# Altium schematic sheet adaptador.SchDoc
size A2
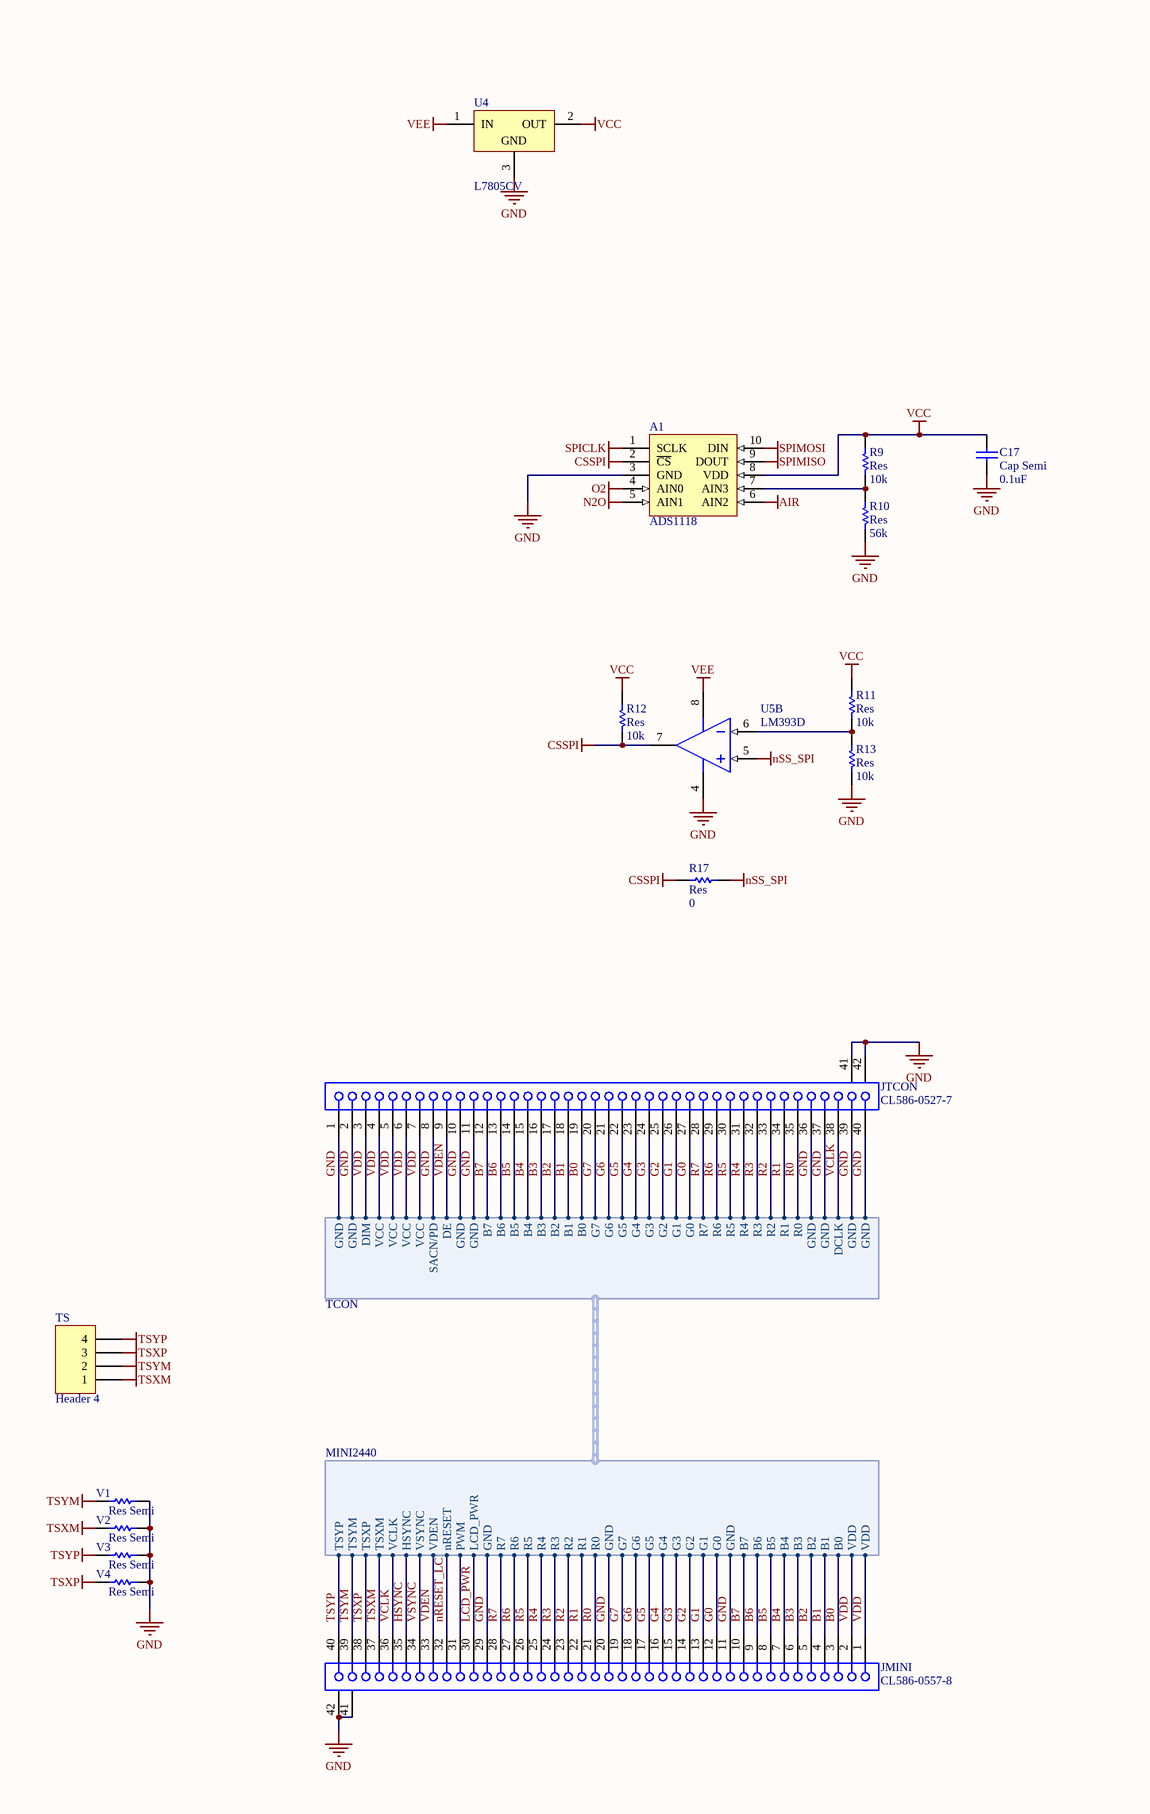
[diagram p0: adaptador.SchDoc, left]
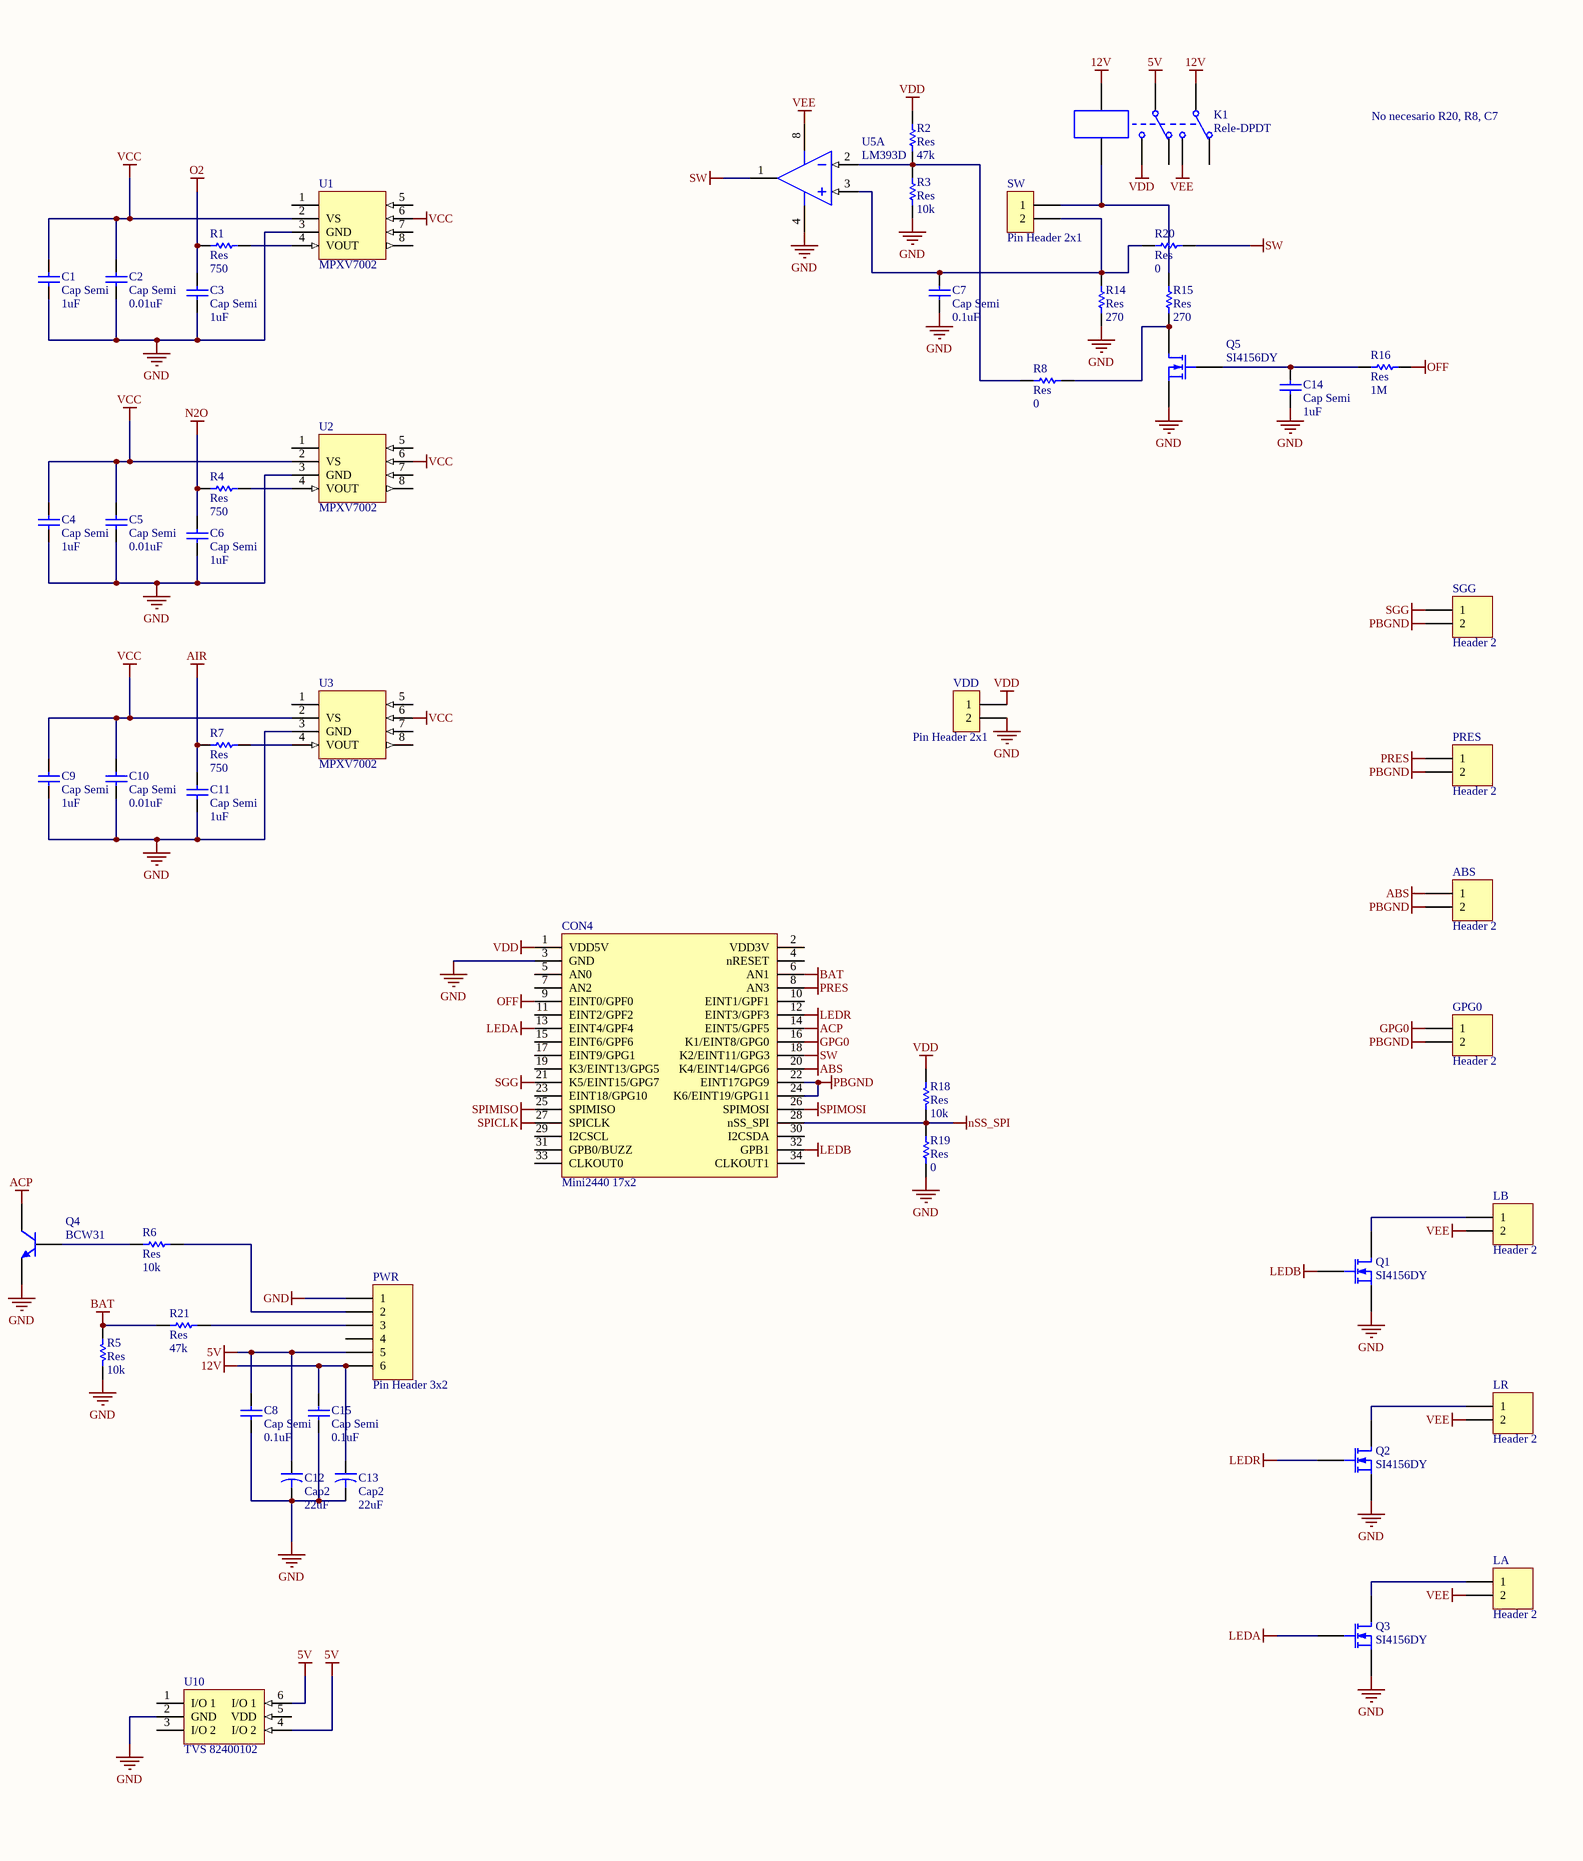
[diagram p1: adaptador.SchDoc, right]

## Parts
A1  ADS1118  [MSOP-10]
ABS  Header 2  [Sherlock2H]
C1  Cap Semi  value 1uF  [8-1206]
C2  Cap Semi  value 0.01uF  [8-1206]
C3  Cap Semi  value 1uF  [8-1206]
C4  Cap Semi  value 1uF  [8-1206]
C5  Cap Semi  value 0.01uF  [8-1206]
C6  Cap Semi  value 1uF  [8-1206]
C7  Cap Semi  value 0.1uF  [8-1206]
C8  Cap Semi  value 0.1uF  [8-1206]
C9  Cap Semi  value 1uF  [8-1206]
C10  Cap Semi  value 0.01uF  [8-1206]
C11  Cap Semi  value 1uF  [8-1206]
C12  Cap2  value 22uF  [CAPPR2-5x6.8]
C13  Cap2  value 22uF  [CAPPR2-5x6.8]
C14  Cap Semi  value 1uF  [8-1206]
C15  Cap Semi  value 0.1uF  [8-1206]
C17  Cap Semi  value 0.1uF  [8-1206]
CON4  Mini2440 17x2  [HDR2X17HV]
GPG0  Header 2  [Sherlock2H]
JMINI  CL586-0557-8  [FH12-40S-0.5SHD]
JTCON  CL586-0527-7  [FH12-40S-0.5SHD]
K1  Rele-DPDT  [RELE-DPDT]
LA  Header 2  [Sherlock2H]
LB  Header 2  [Sherlock2H]
LR  Header 2  [Sherlock2H]
PRES  Header 2  [Sherlock2H]
PWR  Pin Header 3x2  [bigHDR2X3]
Q1  SI4156DY  [SO8_M_MOSFET]
Q2  SI4156DY  [SO8_M_MOSFET]
Q3  SI4156DY  [SO8_M_MOSFET]
Q4  BCW31  [SOT-23A]
Q5  SI4156DY  [SO8_M_MOSFET]
R1  Res  value 750  [8-1206]
R2  Res  value 47k  [8-1206]
R3  Res  value 10k  [8-1206]
R4  Res  value 750  [8-1206]
R5  Res  value 10k  [8-1206]
R6  Res  value 10k  [8-1206]
R7  Res  value 750  [8-1206]
R8  Res  value 0  [8-1206]
R9  Res  value 10k  [8-1206]
R10  Res  value 56k  [8-1206]
R11  Res  value 10k  [8-1206]
R12  Res  value 10k  [8-1206]
R13  Res  value 10k  [8-1206]
R14  Res  value 270  [8-1206]
R15  Res  value 270  [8-1206]
R16  Res  value 1M  [8-1206]
R17  Res  value 0  [8-1206]
R18  Res  value 10k  [8-1206]
R19  Res  value 0  [8-1206]
R20  Res  value 0  [8-1206]
R21  Res  value 47k  [8-1206]
SGG  Header 2  [Sherlock2H]
SW  Pin Header 2x1  [Sherlock2H]
TS  Header 4  [HDR1X4]
U1  MPXV7002  [CASE 1351-01]
U2  MPXV7002  [CASE 1351-01]
U3  MPXV7002  [CASE 1351-01]
U4  L7805CV  [TO220ABN]
U5  LM393D  [SO8_M]  (parts A,B of 2)
U10  TVS 82400102  [SOT23-6]
V1  Res Semi  [RESC1608L]
V2  Res Semi  [RESC1608L]
V3  Res Semi  [RESC1608L]
V4  Res Semi  [RESC1608L]
VDD  Pin Header 2x1  [Sherlock2H]

## Harnesses
TCON: GND, GND, DIM, VCC, VCC, VCC, VCC, SACN/PD, DE, GND, GND, B7, B6, B5, B4, B3, B2, B1, B0, G7, G6, G5, G4, G3, G2, G1, G0, R7, R6, R5, R4, R3, R2, R1, R0, GND, GND, DCLK, GND, GND
MINI2440: GND, GND, GND, VDD, VDD, TSXM, TSXP, TSYM, TSYP, LCD_PWR, nRESET, VSYNC, HSYNC, VCLK, VDEN, PWM, R7, R0, R1, R2, R3, R4, R5, R6, G0, G1, G2, G3, G4, G5, G6, G7, B0, B1, B2, B3, B4, B5, B6, B7

## Nets
5V: C8.2 C12.1 K1.7 PWR.5 U10.4(I/O_2) U10.6(I/O_1)
12V: C13.1 C15.2 K1.2 K1.8 PWR.6
ABS: ABS.1 CON4.20(K4/EINT14/GPG6)
ACP: CON4.14(EINT5/GPF5) Q4.3(C)
AIR: A1.6(AIN2) C11.2 R7.1
BAT: CON4.6(AN1) R5.1 R21.2
CSSPI: A1.2(~{CS}) R12.2 R17.2 U5.7(OUT)
GND: A1.3(GND) C1.1 C2.1 C3.1 C4.1 C5.1 C6.1 C7.1 C8.1 C9.1 C10.1 C11.1 C12.2 C13.2 C14.1 C15.1 C17.1 CON4.3(GND) JMINI.11 JMINI.20 JMINI.29 JMINI.41(MH1) JMINI.42(MH2) JTCON.1 JTCON.2 JTCON.8 JTCON.10 JTCON.11 JTCON.36 JTCON.37 JTCON.39 JTCON.40 JTCON.41(MH1) JTCON.42(MH2) PWR.1 Q1.3(S) Q2.3(S) Q3.3(S) Q4.2(E) Q5.3(S) R3.1 R5.2 R10.1 R13.2 R14.1 R19.2 U1.3(GND) U2.3(GND) U3.3(GND) U4.3(GND) U5.4(V-) U10.2(GND) V1.2 V2.2 V3.2 V4.2 VDD.2 ; harness TCON.GND, harness TCON.SACN/PD, harness MINI2440.GND
GPG0: CON4.16(K1/EINT8/GPG0) GPG0.1
LEDA: CON4.13(EINT4/GPF4) Q3.2(G)
LEDB: CON4.32(GPB1) Q1.2(G)
LEDR: CON4.12(EINT3/GPF3) Q2.2(G)
N2O: A1.5(AIN1) C6.2 R4.1
nSS_SPI: CON4.28(nSS_SPI) R17.1 R18.2 R19.1 U5.5(IN+)
O2: A1.4(AIN0) C3.2 R1.1
OFF: CON4.9(EINT0/GPF0) R16.1
PBGND: ABS.2 CON4.22(EINT17GPG9) CON4.24(K6/EINT19/GPG11) GPG0.2 PRES.2 SGG.2
PRES: CON4.8(AN3) PRES.1
SGG: CON4.21(K5/EINT15/GPG7) SGG.1
SPICLK: A1.1(SCLK) CON4.27(SPICLK)
SPIMISO: A1.9(DOUT) CON4.25(SPIMISO)
SPIMOSI: A1.10(DIN) CON4.26(SPIMOSI)
SW: CON4.18(K2/EINT11/GPG3) R20.1 U5.1(OUT)
TSXM: JMINI.37 TS.1 V2.1 ; harness MINI2440.TSXM
TSXP: JMINI.38 TS.3 V4.1 ; harness MINI2440.TSXP
TSYM: JMINI.39 TS.2 V1.1 ; harness MINI2440.TSYM
TSYP: JMINI.40 TS.4 V3.1 ; harness MINI2440.TSYP
VCC: A1.8(VDD) C1.2 C2.2 C4.2 C5.2 C9.2 C10.2 C17.2 R9.2 R11.1 R12.1 U1.2(VS) U1.6 U2.2(VS) U2.6 U3.2(VS) U3.6 U4.2(OUT)
VDD: CON4.1(VDD5V) JMINI.1 JMINI.2 JTCON.3 JTCON.4 JTCON.5 JTCON.6 JTCON.7 K1.5 R2.2 R18.1 VDD.1 ; harness TCON.DIM, harness TCON.VCC, harness MINI2440.VDD
VEE: K1.4 LA.2 LB.2 LR.2 U4.1(IN) U5.8(V+)
B0: JMINI.3 JTCON.19 ; harness TCON.B0, harness MINI2440.B0
B1: JMINI.4 JTCON.18 ; harness TCON.B1, harness MINI2440.B1
B2: JMINI.5 JTCON.17 ; harness TCON.B2, harness MINI2440.B2
B3: JMINI.6 JTCON.16 ; harness TCON.B3, harness MINI2440.B3
B4: JMINI.7 JTCON.15 ; harness TCON.B4, harness MINI2440.B4
B5: JMINI.8 JTCON.14 ; harness TCON.B5, harness MINI2440.B5
B6: JMINI.9 JTCON.13 ; harness TCON.B6, harness MINI2440.B6
B7: JMINI.10 JTCON.12 ; harness TCON.B7, harness MINI2440.B7
G0: JMINI.12 JTCON.27 ; harness TCON.G0, harness MINI2440.G0
G1: JMINI.13 JTCON.26 ; harness TCON.G1, harness MINI2440.G1
G2: JMINI.14 JTCON.25 ; harness TCON.G2, harness MINI2440.G2
G3: JMINI.15 JTCON.24 ; harness TCON.G3, harness MINI2440.G3
G4: JMINI.16 JTCON.23 ; harness TCON.G4, harness MINI2440.G4
G5: JMINI.17 JTCON.22 ; harness TCON.G5, harness MINI2440.G5
G6: JMINI.18 JTCON.21 ; harness TCON.G6, harness MINI2440.G6
G7: JMINI.19 JTCON.20 ; harness TCON.G7, harness MINI2440.G7
HSYNC: JMINI.35 ; harness MINI2440.HSYNC
LCD_PWR: JMINI.30 ; harness MINI2440.LCD_PWR
nRESET_LCD: JMINI.32 ; harness MINI2440.nRESET
R0: JMINI.21 JTCON.35 ; harness TCON.R0, harness MINI2440.R0
R1: JMINI.22 JTCON.34 ; harness TCON.R1, harness MINI2440.R1
R2: JMINI.23 JTCON.33 ; harness TCON.R2, harness MINI2440.R2
R3: JMINI.24 JTCON.32 ; harness TCON.R3, harness MINI2440.R3
R4: JMINI.25 JTCON.31 ; harness TCON.R4, harness MINI2440.R4
R5: JMINI.26 JTCON.30 ; harness TCON.R5, harness MINI2440.R5
R6: JMINI.27 JTCON.29 ; harness TCON.R6, harness MINI2440.R6
R7: JMINI.28 JTCON.28 ; harness TCON.R7, harness MINI2440.R7
VCLK: JMINI.36 JTCON.38 ; harness TCON.DCLK, harness MINI2440.VCLK
VDEN: JMINI.33 JTCON.9 ; harness TCON.DE, harness MINI2440.VDEN
VSYNC: JMINI.34 ; harness MINI2440.VSYNC
NetA1_7: A1.7(AIN3) R9.1 R10.2
NetC7_2: C7.2 R14.2 R20.2 SW.2 U5.3(IN+)
NetC14_2: C14.2 Q5.2(G) R16.2
NetJMINI_31: JMINI.31 ; harness MINI2440.PWM
NetK1_1: K1.1 R15.2 SW.1
NetLA_1: LA.1 Q3.1(D)
NetLB_1: LB.1 Q1.1(D)
NetLR_1: LR.1 Q2.1(D)
NetPWR_2: PWR.2 R6.2
NetPWR_3: PWR.3 R21.1
NetQ4_1: Q4.1(B) R6.1
NetQ5_1: Q5.1(D) R8.1 R15.1
NetR1_2: R1.2 U1.4(VOUT)
NetR2_1: R2.1 R3.2 R8.2 U5.2(IN-)
NetR4_2: R4.2 U2.4(VOUT)
NetR7_2: R7.2 U3.4(VOUT)
NetR11_2: R11.2 R13.1 U5.6(IN-)

Not connected (* = marked no-connect by the designer): CON4 2(VDD3V) 4(nRESET) 5(AN0) 7(AN2) 10(EINT1/GPF1) 11(EINT2/GPF2) 15(EINT6/GPF6) 17(EINT9/GPG1) 19(K3/EINT13/GPG5) 23(EINT18/GPG10) 29(I2CSCL) 30(I2CSDA) 31(GPB0/BUZZ) 33(CLKOUT0) 34(CLKOUT1); K1 3 6; PWR 4; U1 1 5 7 8; U2 1 5 7 8; U3 1 5 7 8; U10 1(I/O_1) 3(I/O_2) 5(VDD)

## Notes on the sheet
- No necesario R20, R8, C7

## Library data of the parts
ABS GPG0 = Header 2: mini_header 2x1; PackageReference: TH; Supplier Web Link: http://mexico.newark.com/jst-japan-solderless-terminals/s2b-ph-k-s-lf-sn/wire-to-board-conn-header-2pos/dp/38K8066?Ntt=38K8066; Supplier 1: Newark; Supplier Part Number 1: 57R9772
C1-C11 C14 C15 C17 = Cap Semi: Capacitor cerámico; Supplier 1: Newark
  C1 C4 C9 C14: PackageReference: SMD; Supplier Part Number 1: 06R4217; Supplier Web Link: http://mexico.newark.com/multicomp/mc1206b105k500ct/capacitor-ceramic-1uf-50v-x7r-1206/dp/06R4217?Ntt=06R4217
  C2 C5 C10: PackageReference: SMD; Supplier Part Number 1: 06R4197; Supplier Web Link: http://mexico.newark.com/multicomp/mc1206b103k500ct/capacitor-ceramic-0-01uf-50v-x7r/dp/06R4197?Ntt=06R4197
  C3 C6 C11: PackageReference: SMD; Supplier Part Number 1: 90R7807; Supplier Web Link: http://mexico.newark.com/tdk/c3216x7r1h334k/capacitor-ceramic-0-33uf-50v-x7r/dp/90R7807?Ntt=90R7807
  C7: Supplier Part Number 1: 06R4208
  C8 C15 C17: PackageReference: SMD; Supplier Part Number 1: 06R4208; Supplier Web Link: http://mexico.newark.com/multicomp/mc1206b104k500ct/capacitor-ceramic-0-1uf-50v-x7r/dp/06R4208?Ntt=06R4208
C12 C13 = Cap2: Capacitor; Published: 23-Sep-2002; PackageReference: CAPR5-4X5; Publisher: Altium Limited; Supplier 1: Newark; Supplier Part Number 1: 70K9703
CON4 = Mini2440 17x2: Header, 17-Pin, Dual row; LatestRevisionDate: 17-Jul-2002; LatestRevisionNote: Re-released for DXP Platform.; Publisher: Altium Limited; Supplier 1: Newark; Supplier Part Number 1: 59J1840
JMINI = CL586-0557-8: FPC 40pos 0.5mm; Manufacturer: OMRON; PartNumber: XF2M-4015-1A; PackageReference: SMD; Supplier 1: Newark; Supplier Part Number 1: 41M0934; Supplier Web Link: http://mexico.newark.com/omron-electronic-components/xf2m-4015-1a/ffc-fpc-conn-receptacle-40way-1row/dp/41M0934?Ntt=41M0934
JTCON = CL586-0527-7: FPC 40pos 0.5mm; Manufacturer: OMRON; PartNumber: XF2M-4015-1A; PackageReference: SMD; Supplier 1: Newark; Supplier Part Number 1: 41M0934; Supplier Web Link: http://mexico.newark.com/omron-electronic-components/xf2m-4015-1a/ffc-fpc-conn-receptacle-40way-1row/dp/41M0934?Ntt=41M0934
K1 = Rele-DPDT: Dual-Pole Dual-Throw Relay; Published: 24-Mar-1999; LatestRevisionDate: 17-Jul-2002; LatestRevisionNote: Re-released for DXP Platform.; PackageReference: DIP-P8; Publisher: Altium Limited; Supplier 1: Newark; Supplier Part Number 1: 12P9634
LA LB LR PRES SGG = Header 2: mini_header 2x1; Manufacturer: JST; PartNumber: S2B-PH-K-S; PackageReference: TH; Supplier Web Link: http://mexico.newark.com/jst-japan-solderless-terminals/s2b-ph-k-s-lf-sn/wire-to-board-conn-header-2pos/dp/38K8066?Ntt=38K8066; Supplier 1: Newark; Supplier Part Number 1: 57R9772
PWR = Vertical Pin Header 3x2: Minifit 6pos v/h 4.2mm; Manufacturer: JST; PartNumber: S2B-PH-K-S; Supplier 1: Newark; Supplier Part Number 1: 02N4683; PackageReference: TH; Supplier Web Link: http://mexico.newark.com/multicomp/mc34661/wire-board-connector-rcpt-6pos/dp/02N4683?Ntt=02N4683
Q1-Q3 Q5 = MOSFET-N: N-Channel MOSFET; Manufacturer: Vishay; Manufacturer 1: Mouser; Manufacturer Part Number 1: 781-SI4156DY-GE3; PackageReference: SMD; Supplier 1: Mouser; Supplier Part Number 1: 781-SI4156DY-GE3; PartNumber: SI4156DY; Supplier Unit Price 1: 0.741; Supplier Web Link: http://mx.mouser.com/ProductDetail/Vishay-Siliconix/SI4156DY-T1-GE3/?qs=sGAEpiMZZMvECErq9cesgOUVEgrRHvSKznvA31eeUYo%3d; Supplier 2: Newark; Supplier Part Number 2: 35R6233
Q4 = BCW31: NPN Epitaxial Silicon Transistor; Published: 8-Jun-2000; LatestRevisionDate: 17-Jul-2002; LatestRevisionNote: Re-released for DXP Platform.; DatasheetDocument: 1999; PackageDocument: Sep-1998; PackageReference: SOT-23A; Publisher: Altium Limited; ComponentLink1Description: Manufacturer Link; ComponentLink1URL: http://www.fairchildsemi.com/; ComponentLink2Description: Datasheet; ComponentLink2URL: http://www.fairchildsemi.com/ds/BC%2FBCW31.pdf; Supplier 1: Newark; Supplier Part Number 1: 75R0729; Supplier 2: Newark; Supplier Part Number 2: 79R4964
R1-R21 = Res: Resistor; PackageReference: SMD; Supplier 1: Newark
  R1 R4 R7: Supplier Part Number 1: 79M6231; Supplier Web Link: http://mexico.newark.com/multicomp/mc1206s4f7500t5e/resistor-thick-film-750ohm-125mw/dp/79M6231?Ntt=79M6231
  R2 R21: Supplier Web Link: http://mexico.newark.com/multicomp/mc1206s4f1800t5e/resistor-thick-film-180ohm-125mw/dp/79M6155?Ntt=79M6155; Supplier Part Number 1: 64R5472
  R3: Supplier Web Link: http://mexico.newark.com/multicomp/mc1206s4f1800t5e/resistor-thick-film-180ohm-125mw/dp/79M6155?Ntt=79M6155; Supplier Part Number 1: 39K0872
  R5 R6 R9 R11-R13 R18: Supplier Web Link: http://mexico.newark.com/yageo-phycomp/rc1206fr-07100kl/resistor-100kohm-250mw-1/dp/98K7623?Ntt=98K7623; Supplier Part Number 1: 39K0872
  R8 R17 R19 R20: Supplier Web Link: http://mexico.newark.com/multicomp/mc1206s4f1800t5e/resistor-thick-film-180ohm-125mw/dp/79M6155?Ntt=79M6155; Supplier Part Number 1: 39K0990
  R10: Supplier Web Link: http://mexico.newark.com/yageo-phycomp/rc1206fr-07100kl/resistor-100kohm-250mw-1/dp/98K7623?Ntt=98K7623; Supplier Part Number 1: 59M7005
  R14 R15: Supplier Web Link: http://mexico.newark.com/multicomp/mc1206s4f1800t5e/resistor-thick-film-180ohm-125mw/dp/79M6155?Ntt=79M6155; Supplier Part Number 1: 79M6173
  R16: Supplier Part Number 1: 68R0301; Supplier Web Link: http://mexico.newark.com/yageo/rc1206jr-071ml/resistor-thick-film-1mohm-250mw/dp/68R0301?Ntt=68R0301
SW VDD = Vertical Pin Header PCB 2x1: mini_header 2x1; Manufacturer: JST; PartNumber: S2B-PH-K-S; PackageReference: TH; Supplier Web Link: http://mexico.newark.com/jst-japan-solderless-terminals/s2b-ph-k-s-lf-sn/wire-to-board-conn-header-2pos/dp/38K8066?Ntt=38K8066; Supplier 1: Newark; Supplier Part Number 1: 57R9772
TS = Header 4: Header 4pos 2.54mm; Supplier 1: Newark; Supplier Part Number 1: 08N6746; PackageReference: TH; Supplier Web Link: http://mexico.newark.com/multicomp/2211s-04g/board-board-connector-header-4way/dp/08N6746?Ntt=08N6746
U1-U3 = MPXV7002: Sensor de presión diferencial; Supplier 1: Newark; Supplier Part Number 1: 70K3588; PackageReference: SMD; Supplier Web Link: http://mexico.newark.com/freescale-semiconductor/mpxv7002dpt1/ic-pressure-sensor-2-to-2kpa-sop/dp/70K3588?Ntt=70K3588
U4 = L7805CV: Positive Voltage Regulator; Note: Tab is connected to pin 3 (GND).; Published: 24-Aug-2001; LatestRevisionDate: 17-Jul-2002; LatestRevisionNote: Re-released for DXP Platform.; DatasheetVersion: Dec-1998; PackageVersion: Jun-1998; PackageReference: TO220ABN; Publisher: Altium Limited; PackageDescription: TO, Thru-Hole, Vertical, Heatsink Mounted; 3 In-Line Leads; Pitch 2.54 mm; Pin sequence 1, 3, 2; ComponentLink1Description: Manufacturer Link; ComponentLink1URL: http://www.st.com/; Supplier 1: Newark; Supplier Part Number 1: 89K0780
U5 = LM393D: Low-Power Dual Voltage Comparator; Published: 24-Aug-2001; LatestRevisionDate: 13-Apr-2006; LatestRevisionNote: IPC-7351 Footprint Added.; DatasheetVersion: Jun-1998; PackageVersion: Dec-2002; PackageReference: SO8; Publisher: Altium Limited; PackageDescription: 8-Pin Small Outline Integrated Circuit 1.27 mm Pitch; Code_JEDEC: MS-012-AA; Code_IPC: SOIC127P600-8; ComponentLink1Description: Manufacturer Link; ComponentLink1URL: http://www.st.com/; ComponentLink2Description: Datasheet; ComponentLink2URL: http://www.st.com/stonline/products/literature/ds/2164/lm293.pdf; Supplier 1: Newark; Supplier Part Number 1: 88H4662
U10 = TVS 82400102: Electric Field Imaging Device; PackageDescription: 24 LD SOIC 1.27 pitch 7.5x15.4; Supplier 1: Newark; Supplier Part Number 1: 79R6945
V1-V4 = Res Semi: Semiconductor Resistor; Published: 8-Jun-2000; LatestRevisionDate: 17-Jul-2002; LatestRevisionNote: Re-released for DXP Platform.; PackageReference: AXIAL-0.5; Publisher: Altium Limited
A1 = ADS1118: Supplier Web Link: http://mexico.newark.com/jsp/search/productdetail.jsp?sku=57T9643; Supplier 1: Newark; Supplier Part Number 1: 57T9643